# Altium schematic sheet ANALOG.SchDoc
size A3
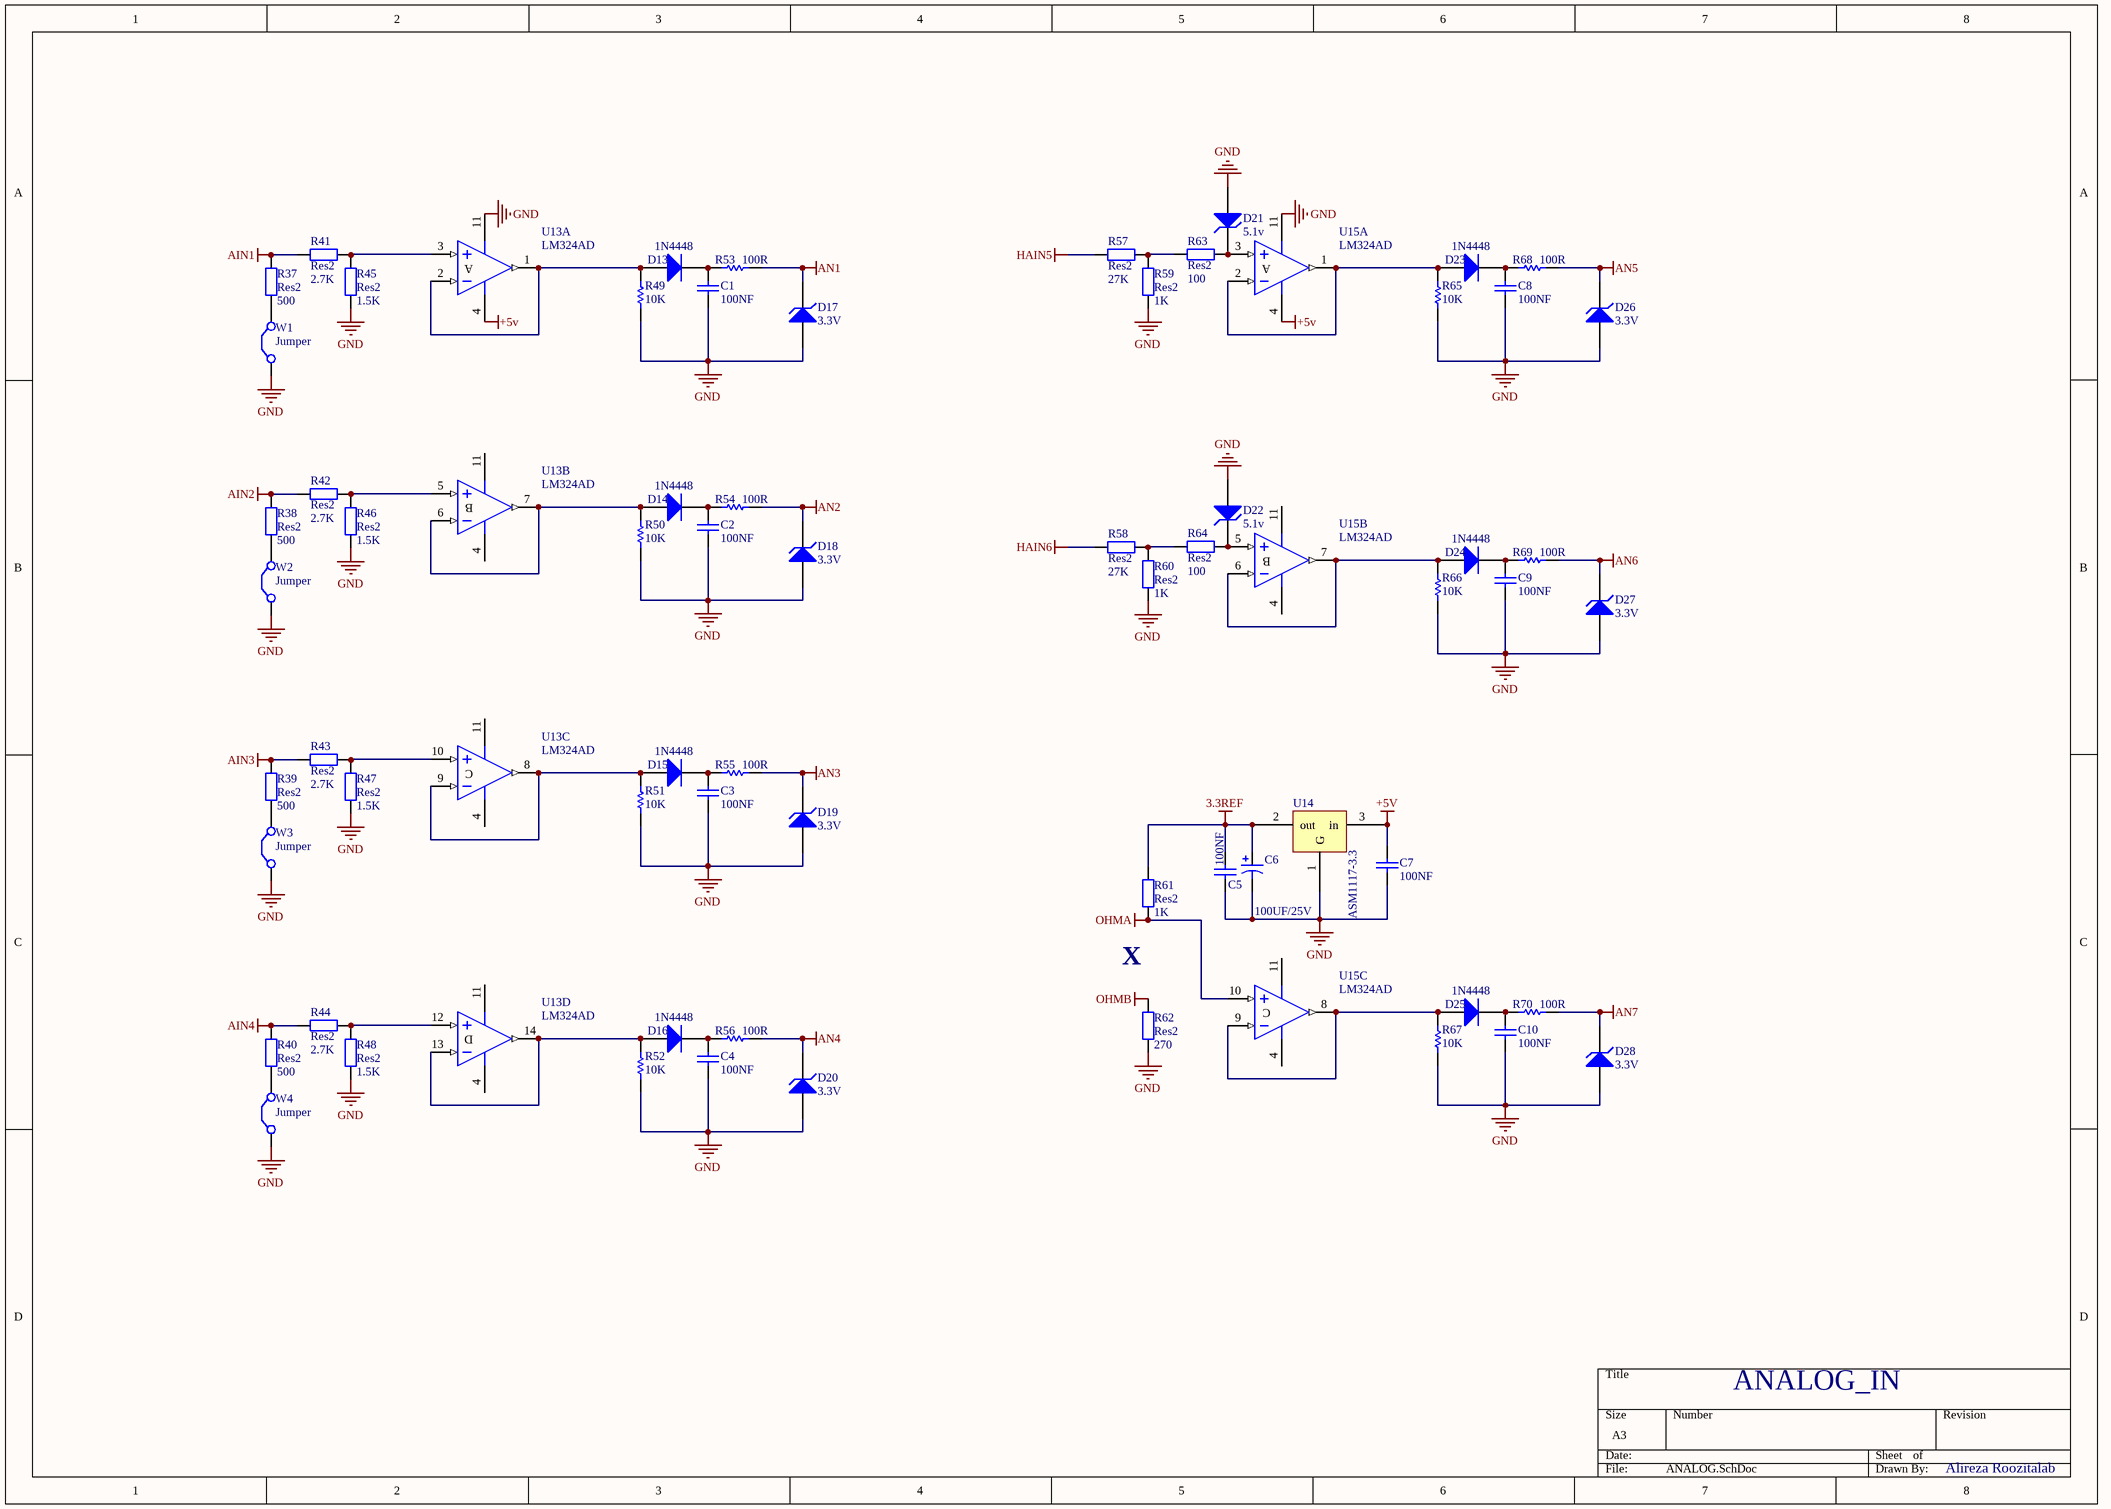
[diagram p0: ANALOG.SchDoc]

## Parts
C1  value 100NF  [CAP 1206 (3216X08L)]  (hidden comment: Cap)
C2  value 100NF  [CAP 1206 (3216X08L)]  (hidden comment: Cap)
C3  value 100NF  [CAP 1206 (3216X08L)]  (hidden comment: Cap)
C4  value 100NF  [CAP 1206 (3216X08L)]  (hidden comment: Cap)
C5  value 100NF  [CAP 1206 (3216X08L)]  (hidden comment: Cap)
C6  value 100UF/25V  [POL 100U/25V]  (hidden comment: Cap Pol1)
C7  value 100NF  [CAP 1206 (3216X08L)]  (hidden comment: Cap)
C8  value 100NF  [CAP 1206 (3216X08L)]  (hidden comment: Cap)
C9  value 100NF  [CAP 1206 (3216X08L)]  (hidden comment: Cap)
C10  value 100NF  [CAP 1206 (3216X08L)]  (hidden comment: Cap)
D13  1N4448  [Diode-1n4148 - SMD PAD]
D14  1N4448  [Diode-1n4148 - SMD PAD]
D15  1N4448  [Diode-1n4148 - SMD PAD]
D16  1N4448  [Diode-1n4148 - SMD PAD]
D17  3.3V  [Diode-1n4148 - SMD PAD]
D18  3.3V  [Diode-1n4148 - SMD PAD]
D19  3.3V  [Diode-1n4148 - SMD PAD]
D20  3.3V  [Diode-1n4148 - SMD PAD]
D21  5.1v  [Diode-1n4148 - SMD PAD]
D22  5.1v  [Diode-1n4148 - SMD PAD]
D23  1N4448  [Diode-1n4148 - SMD PAD]
D24  1N4448  [Diode-1n4148 - SMD PAD]
D25  1N4448  [Diode-1n4148 - SMD PAD]
D26  3.3V  [Diode-1n4148 - SMD PAD]
D27  3.3V  [Diode-1n4148 - SMD PAD]
D28  3.3V  [Diode-1n4148 - SMD PAD]
R37  Res2  value 500  [RES 1206 (3216X08L)]
R38  Res2  value 500  [RES 1206 (3216X08L)]
R39  Res2  value 500  [RES 1206 (3216X08L)]
R40  Res2  value 500  [RES 1206 (3216X08L)]
R41  Res2  value 2.7K  [RES 1206 (3216X08L)]
R42  Res2  value 2.7K  [RES 1206 (3216X08L)]
R43  Res2  value 2.7K  [RES 1206 (3216X08L)]
R44  Res2  value 2.7K  [RES 1206 (3216X08L)]
R45  Res2  value 1.5K  [RES 1206 (3216X08L)]
R46  Res2  value 1.5K  [RES 1206 (3216X08L)]
R47  Res2  value 1.5K  [RES 1206 (3216X08L)]
R48  Res2  value 1.5K  [RES 1206 (3216X08L)]
R49  value 10K  [RES 1206 (3216X08L)]  (hidden comment: Res Semi)
R50  value 10K  [RES 1206 (3216X08L)]  (hidden comment: Res Semi)
R51  value 10K  [RES 1206 (3216X08L)]  (hidden comment: Res Semi)
R52  value 10K  [RES 1206 (3216X08L)]  (hidden comment: Res Semi)
R53  value 100R  [RES 1206 (3216X08L)]  (hidden comment: Res Semi)
R54  value 100R  [RES 1206 (3216X08L)]  (hidden comment: Res Semi)
R55  value 100R  [RES 1206 (3216X08L)]  (hidden comment: Res Semi)
R56  value 100R  [RES 1206 (3216X08L)]  (hidden comment: Res Semi)
R57  Res2  value 27K  [RES 1206 (3216X08L)]
R58  Res2  value 27K  [RES 1206 (3216X08L)]
R59  Res2  value 1K  [RES 1206 (3216X08L)]
R60  Res2  value 1K  [RES 1206 (3216X08L)]
R61  Res2  value 1K  [RES 1206 (3216X08L)]
R62  Res2  value 270  [RES 1206 (3216X08L)]
R63  Res2  value 100  [RES 1206 (3216X08L)]
R64  Res2  value 100  [RES 1206 (3216X08L)]
R65  value 10K  [RES 1206 (3216X08L)]  (hidden comment: Res Semi)
R66  value 10K  [RES 1206 (3216X08L)]  (hidden comment: Res Semi)
R67  value 10K  [RES 1206 (3216X08L)]  (hidden comment: Res Semi)
R68  value 100R  [RES 1206 (3216X08L)]  (hidden comment: Res Semi)
R69  value 100R  [RES 1206 (3216X08L)]  (hidden comment: Res Semi)
R70  value 100R  [RES 1206 (3216X08L)]  (hidden comment: Res Semi)
U13  LM324AD  [SOP-14]  (parts A,B,C,D of 4)
U14  ASM1117-3.3  [SOT-223]
U15  LM324AD  [SOP-14]  (parts A,B,C of 4)
W1  Jumper  [RES 0402 (1005X04L)]
W2  Jumper  [RES 0402 (1005X04L)]
W3  Jumper  [RES 0402 (1005X04L)]
W4  Jumper  [RES 0402 (1005X04L)]

## Nets
3.3REF: C5.2 C6.1 R61.2 U14.2(out)
+5v: C7.2 U13.4(V+) U14.3(in) U15.4(V+)
AIN1: R37.2 R41.1
AIN2: R38.2 R42.1
AIN3: R39.2 R43.1
AIN4: R40.2 R44.1
AN1: D17.2(K) R53.2
AN2: D18.2(K) R54.2
AN3: D19.2(K) R55.2
AN4: D20.2(K) R56.2
AN5: D26.2(K) R68.2
AN6: D27.2(K) R69.2
AN7: D28.2(K) R70.2
GND: C1.2 C2.2 C3.2 C4.2 C5.1 C6.2 C7.1 C8.2 C9.2 C10.2 D17.1(A) D18.1(A) D19.1(A) D20.1(A) D21.1(A) D22.1(A) D26.1(A) D27.1(A) D28.1(A) R45.1 R46.1 R47.1 R48.1 R49.1 R50.1 R51.1 R52.1 R59.1 R60.1 R62.1 R65.1 R66.1 R67.1 U13.11(V-) U14.1(G) U15.11(V-) W1.1(C1) W2.1(C1) W3.1(C1) W4.1(C1)
HAIN5: R57.1
HAIN6: R58.1
OHMA: R61.1 U15.10(IN+)
OHMB: R62.2
NetC1_1: C1.1 D13.2(K) R53.1
NetC2_1: C2.1 D14.2(K) R54.1
NetC3_1: C3.1 D15.2(K) R55.1
NetC4_1: C4.1 D16.2(K) R56.1
NetC8_1: C8.1 D23.2(K) R68.1
NetC9_1: C9.1 D24.2(K) R69.1
NetC10_1: C10.1 D25.2(K) R70.1
NetD13_1: D13.1(A) R49.2 U13.1(OUT) U13.2(IN-)
NetD14_1: D14.1(A) R50.2 U13.6(IN-) U13.7(OUT)
NetD15_1: D15.1(A) R51.2 U13.8(OUT) U13.9(IN-)
NetD16_1: D16.1(A) R52.2 U13.13(IN-) U13.14(OUT)
NetD21_2: D21.2(K) R63.2 U15.3(IN+)
NetD22_2: D22.2(K) R64.2 U15.5(IN+)
NetD23_1: D23.1(A) R65.2 U15.1(OUT) U15.2(IN-)
NetD24_1: D24.1(A) R66.2 U15.6(IN-) U15.7(OUT)
NetD25_1: D25.1(A) R67.2 U15.8(OUT) U15.9(IN-)
NetR37_1: R37.1 W1.2(C2)
NetR38_1: R38.1 W2.2(C2)
NetR39_1: R39.1 W3.2(C2)
NetR40_1: R40.1 W4.2(C2)
NetR41_2: R41.2 R45.2 U13.3(IN+)
NetR42_2: R42.2 R46.2 U13.5(IN+)
NetR43_2: R43.2 R47.2 U13.10(IN+)
NetR44_2: R44.2 R48.2 U13.12(IN+)
NetR57_2: R57.2 R59.2 R63.1
NetR58_2: R58.2 R60.2 R64.1

## Notes on the sheet
- X
- ANALOG_IN
- Alireza Roozitalab
- (in symbol LM324AD, part A) A
- (in symbol LM324AD, part B) B
- (in symbol LM324AD, part C) C
- (in symbol LM324AD, part D) D

## Library data of the parts
C1-C5 C7-C10 = Cap: Capacitor; Published: 8-Jun-2000; LatestRevisionDate: 17-Jul-2002; LatestRevisionNote: Re-released for DXP Platform.; PackageReference: RAD-0.3; Publisher: Altium Limited
C6 = Cap Pol1: Polarized Capacitor (Radial); Published: 8-Jun-2000; LatestRevisionDate: 17-Jul-2002; LatestRevisionNote: Re-released for DXP Platform.; PackageReference: RB7.6-15; Publisher: Altium Limited
D13-D16 D23-D25 = Diode: Default Diode; Published: 8-Jun-2000; LatestRevisionDate: 17-Jul-2002; LatestRevisionNote: Re-released for DXP Platform.; PackageDocument: Sep-1996; PackageReference: SMC; Publisher: Altium Limited; Code_JEDEC: DO-214-AB
D17-D22 D26-D28 = D Zener: Zener Diode; Published: 8-Jun-2000; LatestRevisionDate: 17-Jul-2002; LatestRevisionNote: Re-released for DXP Platform.; PackageReference: DIODE-0.7; Publisher: Altium Limited
R37-R48 R57-R64 = Res2: Resistor; Published: 8-Jun-2000; LatestRevisionDate: 17-Jul-2002; LatestRevisionNote: Re-released for DXP Platform.; PackageReference: AXIAL-0.4; Publisher: Altium Limited
R49-R56 R65-R70 = Res Semi: Semiconductor Resistor; Published: 8-Jun-2000; LatestRevisionDate: 17-Jul-2002; LatestRevisionNote: Re-released for DXP Platform.; PackageReference: AXIAL-0.5; Publisher: Altium Limited
U13 U15 = LM324AD: Low-Power Quad Operational Amplifier; Published: 24-Aug-2001; LatestRevisionDate: 13-Apr-2006; LatestRevisionNote: IPC-7351 Footprint Added.; DatasheetVersion: Nov-1997; PackageVersion: Sep-1998; PackageReference: SO14; Publisher: Altium Limited; PackageDescription: 14-Pin Small Outline Integrated Circuit 1.27 mm Pitch; Code_IPC: SOIC127P600-14; ComponentLink1Description: Manufacturer Link; ComponentLink1URL: http://www.st.com/; ComponentLink2Description: Datasheet; ComponentLink2URL: http://www.st.com/stonline/products/literature/ds/4797/lm224a.pdf
W1-W4 = Jumper: Jumper Wire; Published: 24-Mar-1999; LatestRevisionDate: 17-Jul-2002; LatestRevisionNote: Re-released for DXP Platform.; PackageReference: RAD-0.2; Publisher: Altium Limited